# EasyEDA Pro project ProProject_ESP32-Gateway_2023-11-01.epro, schematic Schematic1
Create Date: 2023-10-16; Page Name: P1; Project Name: ESP32-Gateway; Schematic Name: Schematic1; Update Date: 2023-10-28; Company: Zheyuan Zhang; Page Size: A3; Version: V2.2
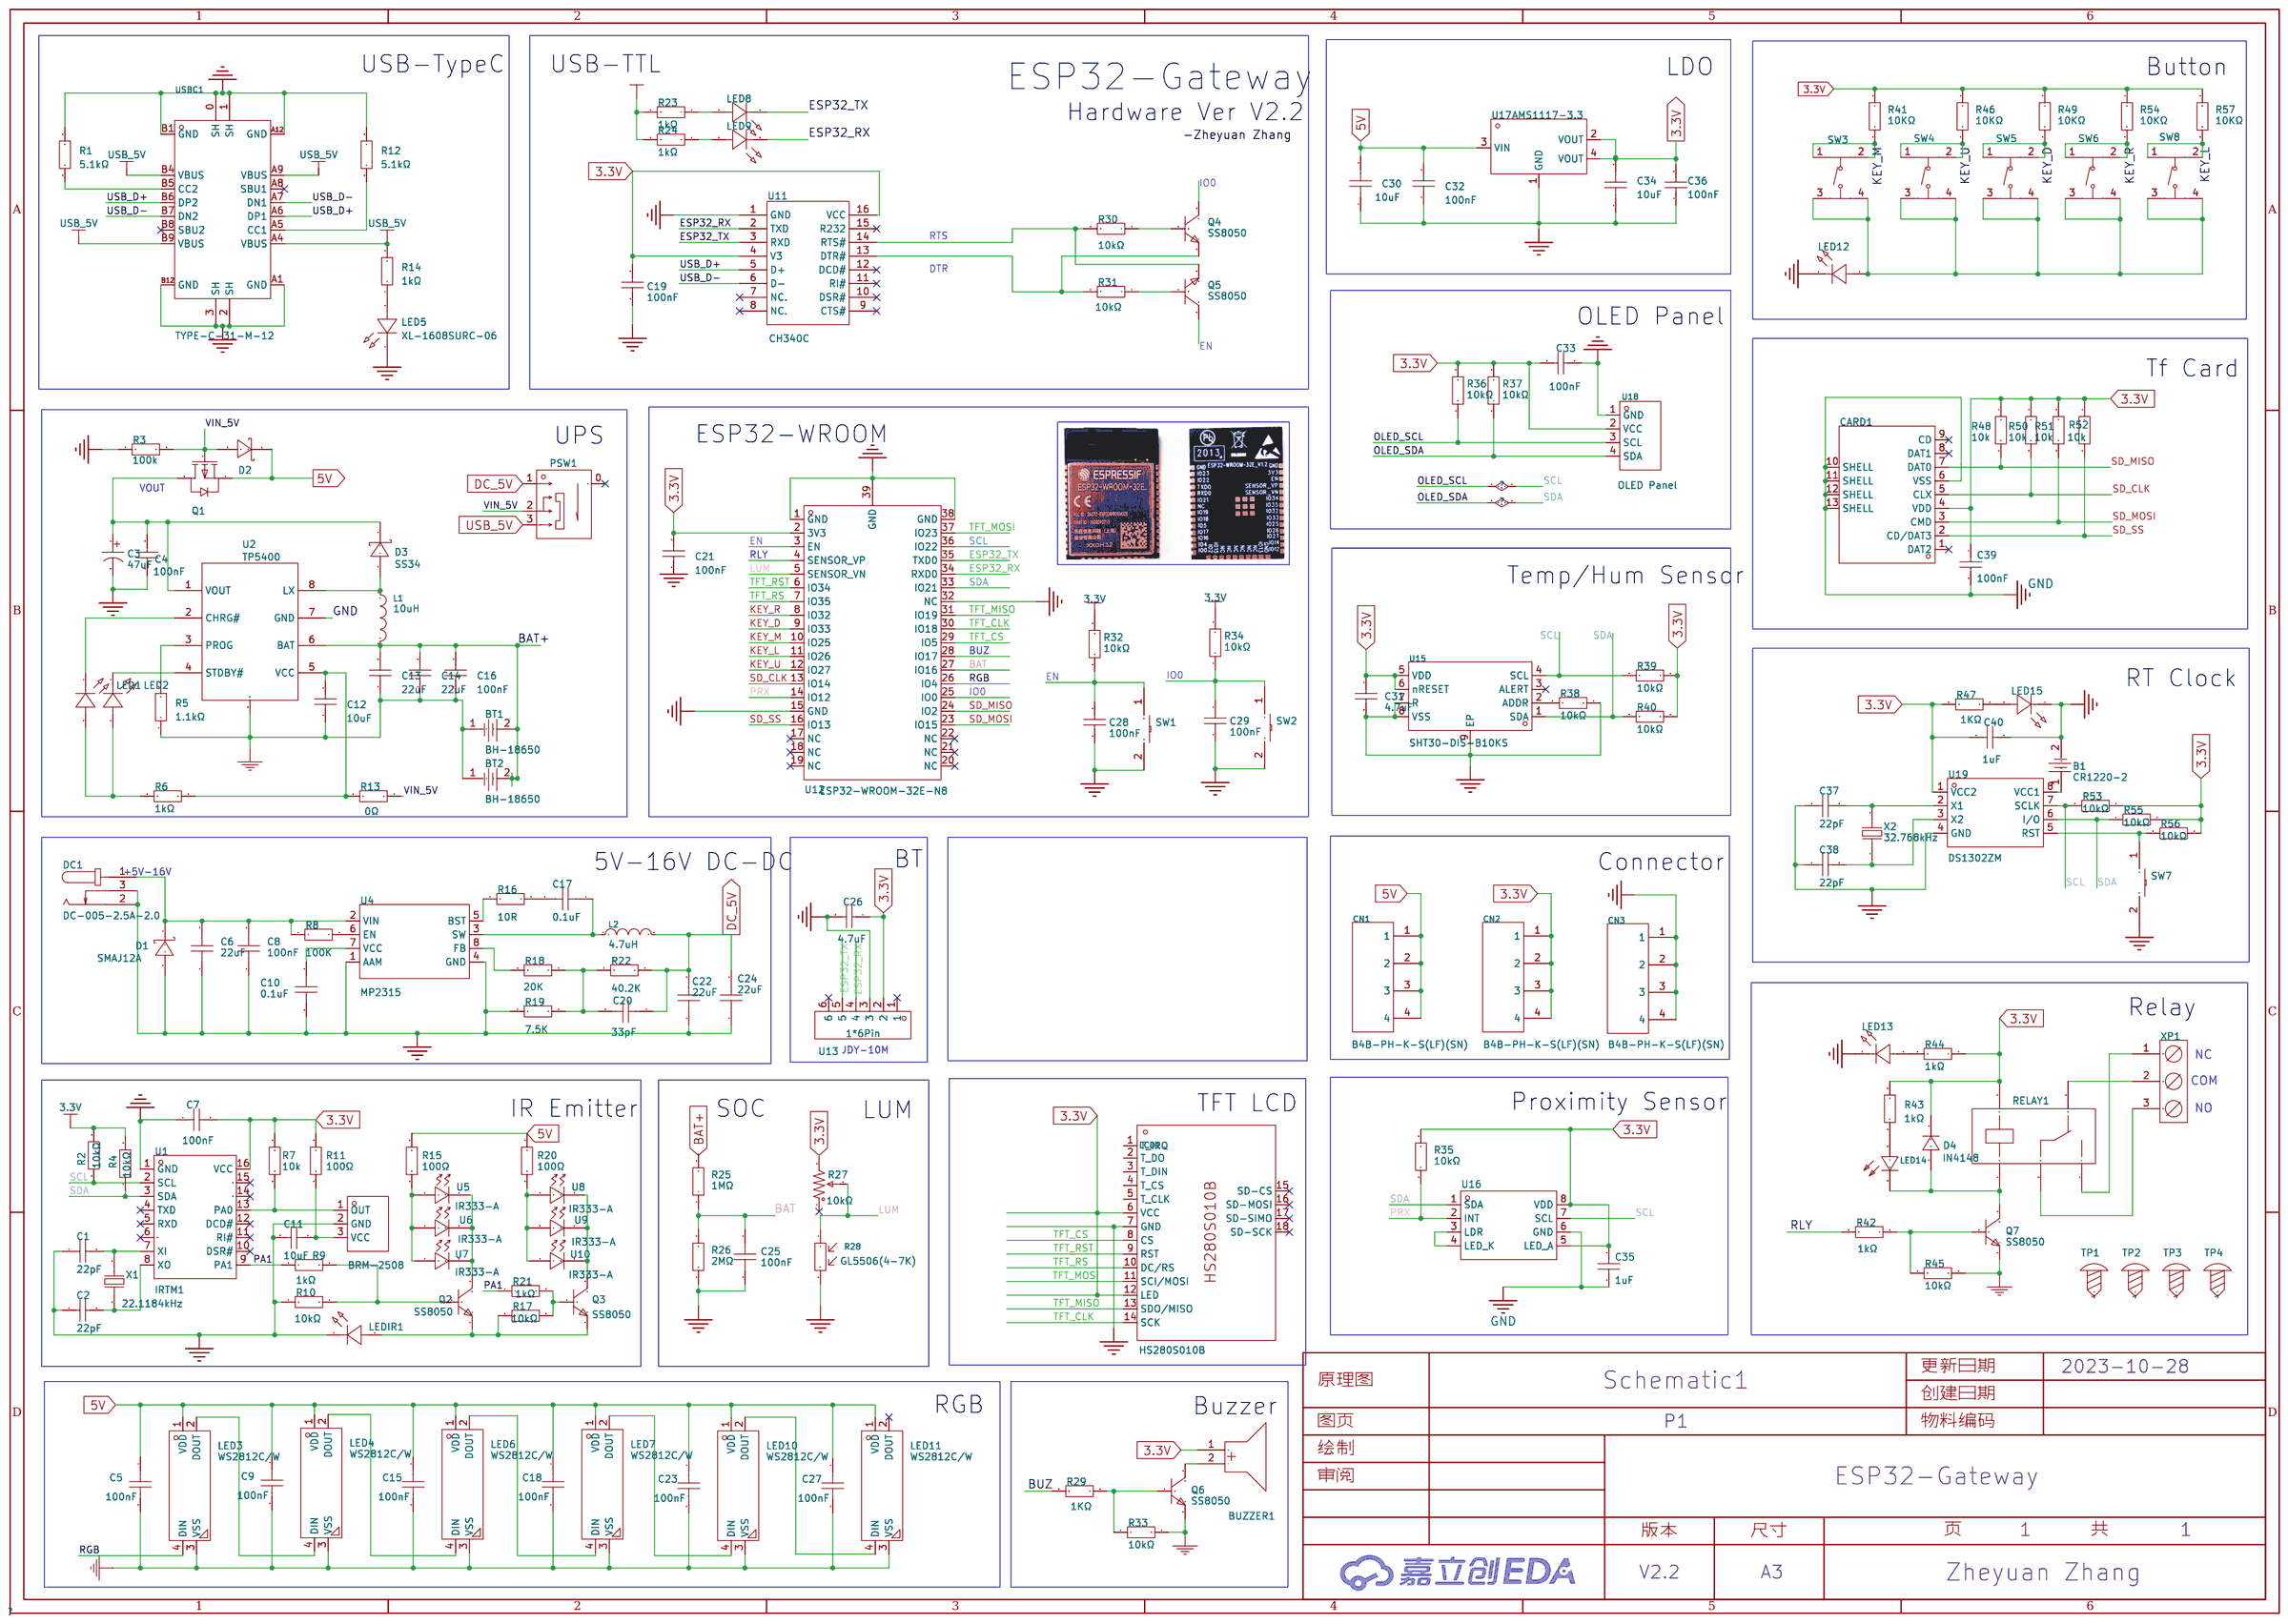
[diagram p2: schematic sheet]

## Parts
B1  CR1220-2  [BAT-SMD_CR1220-2]
BT1  BH-18650  [BAT-TH_BH-18650-A1AJ005]
BT2  BH-18650  [BAT-TH_BH-18650-A1AJ005]
BUZZER1  HNB09A03  [BUZ-TH_BD9.0-P5.00-D0.6-FD]
C1  22pF  [C0603]
C2  22pF  [C0603]
C3  47uF  [CAP-TH_BD6.3-P2.50-D1.0-FD]
C4  100nF  [C0805]
C5  100nF  [C0603]
C6  22uF  [C0805]
C7  100nF  [C0805]
C8  100nF  [C0805]
C9  100nF  [C0603]
C10  0.1uF  [C0603]
C11  10uF  [C0805]
C12  10uF  [C0805]
C13  22uF  [C0805]
C14  22uF  [C0805]
C15  100nF  [C0603]
C16  100nF  [C0805]
C17  0.1uF  [C0603]
C18  100nF  [C0603]
C19  100nF  [C0603]
C20  33pF  [C0603]
C21  100nF  [C0805]
C22  22uF  [C0805]
C23  100nF  [C0603]
C24  22uF  [C0805]
C25  100nF  [C0603]
C26  4.7uF  [C0603]
C27  100nF  [C0603]
C28  100nF  [C0603]
C29  100nF  [C0603]
C30  10uF  [C0603]
C31  4.7uF  [C0603]
C32  100nF  [C0603]
C33  100nF  [C0603]
C34  10uF  [C0603]
C35  1uF  [C0603]
C36  100nF  [C0603]
C37  22pF  [C0603]
C38  22pF  [C0603]
C39  100nF  [C0603]
C40  1uF  [C0603]
CARD1  -  [TF-SMD_THD2528-11SD-GF]
CN1  B4B-PH-K-S(LF)(SN)  [CONN-TH_B4B-PH-K-S]
CN2  B4B-PH-K-S(LF)(SN)  [CONN-TH_B4B-PH-K-S]
CN3  B4B-PH-K-S(LF)(SN)  [CONN-TH_B4B-PH-K-S]
D1  SMAJ12A  [SMA_L4.4-W2.7-LS5.1-RD]
D2  -  [SMA_L4.3-W2.6-LS5.1-RD]
D3  SS34  [DO-214AC_L4.3-W2.7-LS5.3-RD]
D4  IN4148  [DO-35_BD2.0-L4.2-P8.20-D0.5-R-RD]
DC1  DC-005-2.5A-2.0  [CONN-TH_DC-005-2.5A-2.0]
L1  10uH  [IND-SMD_L4.0-W4.0]
L2  4.7uH  [IND-SMD_L5.4-W5.2_FXL0530]
LCD1  HS280S010B  [LCD-TH_HS280S010B]
LED1  XL-1608SURC-06  [LED0603-RD_RED]
LED2  XL-1608SURC-06  [LED0603-RD_RED]
LED3  WS2812C/W  [LED-SMD_4P-L5.0-W5.0-TL_WS2812B-B]
LED4  WS2812C/W  [LED-SMD_4P-L5.0-W5.0-TL_WS2812B-B]
LED5  XL-1608SURC-06  [LED0603-RD_RED]
LED6  WS2812C/W  [LED-SMD_4P-L5.0-W5.0-TL_WS2812B-B]
LED7  WS2812C/W  [LED-SMD_4P-L5.0-W5.0-TL_WS2812B-B]
LED8  XL-1608SURC-06  [LED0603-RD_RED]
LED9  XL-1608SURC-06  [LED0603-RD_RED]
LED10  WS2812C/W  [LED-SMD_4P-L5.0-W5.0-TL_WS2812B-B]
LED11  WS2812C/W  [LED-SMD_4P-L5.0-W5.0-TL_WS2812B-B]
LED12  XL-1608SURC-06  [LED0603-RD_RED]
LED13  XL-1608SURC-06  [LED0603-RD_RED]
LED14  19-217/GHC-YR1S2/3T  [LED0603-RD]
LED15  XL-1608SURC-06  [LED0603-RD_RED]
LEDIR1  XL-1608SURC-06  [LED0603-RD_RED]
PSW1  SK-3296S-01-L1  [SW-SMD_3P-P1.50_L2.7-W6.6]
Q1  -  [SOT-23_L2.9-W1.3-P1.90-LS2.4-BR]
Q2  SS8050  [SOT-23-3_L2.9-W1.3-P1.90-LS2.4-BR]
Q3  SS8050  [SOT-23-3_L2.9-W1.3-P1.90-LS2.4-BR]
Q4  SS8050  [SOT-23-3_L2.9-W1.3-P1.90-LS2.4-BR]
Q5  SS8050  [SOT-23-3_L2.9-W1.3-P1.90-LS2.4-BR]
Q6  SS8050  [SOT-23-3_L2.9-W1.3-P1.90-LS2.4-BR]
Q7  SS8050  [SOT-23-3_L2.9-W1.3-P1.90-LS2.4-BR]
R1  5.1kΩ  [R0603]
R2  10kΩ  [R0603]
R3  100k  [R0603]
R4  10kΩ  [R0603]
R5  1.1kΩ  [R0603]
R6  1kΩ  [R0603]
R7  10k  [R0603]
R8  100K  [R0603]
R9  1kΩ  [R0603]
R10  10kΩ  [R0603]
R11  100Ω  [R0603]
R12  5.1kΩ  [R0603]
R13  0Ω  [R0603]
R14  1kΩ  [R0603]
R15  100Ω  [R0603]
R16  10R  [R0603]
R17  10kΩ  [R0603]
R18  20K  [R0603]
R19  7.5K  [R0603]
R20  100Ω  [R0603]
R21  1kΩ  [R0603]
R22  40.2K  [R0603]
R23  1kΩ  [R0603]
R24  1kΩ  [R0603]
R25  1MΩ  [R0603]
R26  2MΩ  [R0603]
R27  10kΩ  [RES-ADJ-TH_3362P]
R28  GL5506(4-7K)  [RES-TH_L5.1-W4.3-P3.00-D0.5]
R29  1KΩ  [R0603]
R30  10kΩ  [R0603]
R31  10kΩ  [R0603]
R32  10kΩ  [R0603]
R33  10kΩ  [R0603]
R34  10kΩ  [R0603]
R35  10kΩ  [R0603]
R36  10kΩ  [R0603]
R37  10kΩ  [R0603]
R38  10kΩ  [R0603]
R39  10kΩ  [R0603]
R40  10kΩ  [R0603]
R41  10KΩ  [R0603]
R42  1kΩ  [R0603]
R43  1kΩ  [R0603]
R44  1kΩ  [R0603]
R45  10kΩ  [R0603]
R46  10KΩ  [R0603]
R47  1KΩ  [R0603]
R48  10k  [R0603]
R49  10KΩ  [R0603]
R50  10k  [R0603]
R51  10k  [R0603]
R52  10k  [R0603]
R53  10kΩ  [R0603]
R54  10KΩ  [R0603]
R55  10kΩ  [R0603]
R56  10kΩ  [R0603]
R57  10KΩ  [R0603]
RELAY1  HF32F/012-ZS3  [RELAY-TH_HF32F-012-ZS3]
SW1  TS-1101-C-W  [SW-SMD_L6.0-W3.3-LS8.0]
SW2  TS-1101-C-W  [SW-SMD_L6.0-W3.3-LS8.0]
SW3  TS-1187A-B-A-B  [SW-SMD_4P-L5.1-W5.1-P3.70-LS6.5-TL-2]
SW4  TS-1187A-B-A-B  [SW-SMD_4P-L5.1-W5.1-P3.70-LS6.5-TL-2]
SW5  TS-1187A-B-A-B  [SW-SMD_4P-L5.1-W5.1-P3.70-LS6.5-TL-2]
SW6  TS-1187A-B-A-B  [SW-SMD_4P-L5.1-W5.1-P3.70-LS6.5-TL-2]
SW7  TS-1101-C-W  [SW-SMD_L6.0-W3.3-LS8.0]
SW8  TS-1187A-B-A-B  [SW-SMD_4P-L5.1-W5.1-P3.70-LS6.5-TL-2]
TP1  -  [M2螺丝]
TP2  -  [M2螺丝]
TP3  -  [M2螺丝]
TP4  -  [M2螺丝]
U1  IRTM1  [SOIC-16_L9.9-W3.9-P1.27-LS6.0-BL]
U2  TP5400  [SOIC-8_L5.0-W4.0-P1.27-LS6.0-BL-EP2.0]
U3  BRM-2508  [SENSOR-TG_TSOP38236]
U4  MP2315  [SOT-23-8_L3.0-W1.7-P0.65-LS2.8-BR]
U5  IR333-A  [LED-TH_BD6.2-P2.54-FD]
U6  IR333-A  [LED-TH_BD6.2-P2.54-FD]
U7  IR333-A  [LED-TH_BD6.2-P2.54-FD]
U8  IR333-A  [LED-TH_BD6.2-P2.54-FD]
U9  IR333-A  [LED-TH_BD6.2-P2.54-FD]
U10  IR333-A  [LED-TH_BD6.2-P2.54-FD]
U11  CH340C  [SOP-16_L10.0-W3.9-P1.27-LS6.0-BL]
U12  ESP32-WROOM-32E-N8  [WIFI-SMD_ESP32-WROOM-32E]
U13  1*6Pin  [CONN-TH_6P-P2.54_DEALON_DW254W-11-06-85]
U15  SHT30-DIS-B10KS  [DFN-8_L2.5-W2.5-P0.50-BL-EP]
U16  -  [SENSOR-SMD_L3.9-W2.4-P0.95-BL]
U17  AMS1117-3.3  [SOT-223-3_L6.5-W3.4-P2.30-LS7.0-BR]
U18  OLED Panel  [OLED-TH_L27.8-W27.2-P2.54_C9900033791]
U19  DS1302ZM  [SOP-8_L4.9-W3.9-P1.27-LS6.0-BL]
USBC1  TYPE-C-31-M-12  [USB-C_SMD-TYPE-C-31-M-12]
X1  22.1184kHz  [FC-135R_L3.2-W1.5]
X2  32.768kHz  [FC-135R_L3.2-W1.5]
XP1  KF128L-5.0-3P  [CONN-TH_3P-P5.00_KF128L-5.0-3P]

## Library data of the parts
B1 = CR1220-2: 连接器类型:电池底座;适用电池规格:CR1220;工作温度范围:-;; LCSC Part Name: 电池底座 适用电池:CR1220; Supplier Part: C70381; Manufacturer: Q&J; Supplier Footprint: SMD; JLCPCB Part Class: 扩展库; Datasheet: https://atta.szlcsc.com/upload/public/pdf/source/20160427/1461725216696.pdf; Supplier: LCSC; Connector Type: 电池底座; Battery Type: CR1220
BT1 BT2 = BH-18650-A1AJ005: 连接器类型:电池盒;适用电池规格:18650;; LCSC Part Name: 电池盒 适用电池:18650; Supplier Part: C5290176; Manufacturer: MYOUNG(美阳); JLCPCB Part Class: Extended Part; Datasheet: https://atta.szlcsc.com/upload/public/pdf/source/20221129/D0CEC1B107B5F52E469FD9B49033E00F.pdf; Supplier: LCSC; Connector Type: 电池盒; Battery Type: 18650
BUZZER1 = HNB09A03: Supplier: LCSC; Supplier Part: C96102; Manufacturer: Jiangsu Huaneng Elec; JLCPCB Part Class: Extended Part; Frequency: 3kHz
C1 C2 C37 C38 = CC0603JRNPO9BN220: 容值:22pF;精度:±5%;额定电压:50V;材质(温度系数):NP0;; LCSC Part Name: 22pF ±5% 50V; Supplier Part: C105620; Manufacturer: YAGEO(国巨); Supplier Footprint: 0603; JLCPCB Part Class: 扩展库; Datasheet: https://atta.szlcsc.com/upload/public/pdf/source/20170425/1493115771353.pdf; Supplier: LCSC; Tolerance: ±5%; Voltage Rated: 50V; Temperature Coefficient: NP0
C3 = KM476M050E11RR0VH2FP0: 容值:47uF;精度:±20%;额定电压:50V;电容体直径:6.3mm;电容体长度:11mm;脚间距:2.5mm;工作寿命:1000hrs@105℃;; LCSC Part Name: 47uF ±20% 50V; Supplier Part: C45101; Manufacturer: CX(承兴); Supplier Footprint: 插件,D6.3xL11mm; JLCPCB Part Class: Extended Part; Datasheet: https://atta.szlcsc.com/upload/public/pdf/source/20151029/1457707529552.pdf; Supplier: LCSC; Tolerance: ±20%; Rated Voltage: 50V; φD: 6.3mm; L: 11mm; Lead Spacing: 2.5mm; Lifetime @ Temp: 1000hrs@105℃
C4 C7 C11-C14 C16 C21 = CC0805KRX7R9BB104: 容值:100nF;精度:±10%;额定电压:50V;材质(温度系数):X7R;; LCSC Part Name: 100nF ±10% 50V; Supplier Part: C49678; Manufacturer: YAGEO(国巨); Supplier Footprint: 0805; JLCPCB Part Class: 基础库; Datasheet: https://atta.szlcsc.com/upload/public/pdf/source/20151026/1457707504898.pdf; Supplier: LCSC; Tolerance: ±10%; Voltage Rated: 50V; Temperature Coefficient: X7R
C5 C9 C15 C18 C23 C27 = CL10B104KB8NNNC: Supplier: LCSC; Manufacturer: SAMSUNG; Supplier Part: C1591; JLCPCB Part Class: Extended Part
C6 C22 C24 = CL21A226MAYNNNE: 容值:22uF;精度:±20%;额定电压:25V;材质(温度系数):X5R;; LCSC Part Name: 22uF ±20% 25V; Supplier Part: C602037; Manufacturer: SAMSUNG(三星); Supplier Footprint: 0805; JLCPCB Part Class: Extended Part; Datasheet: https://atta.szlcsc.com/upload/public/pdf/source/20200609/C602037_1A0D619693E608A1BF6E80154254E2DB.pdf; Supplier: LCSC; Tolerance: ±20%; Voltage Rated: 25V; Temperature Coefficient: X5R
C8 = CC0805KRX7R9BB104: 容值:100nF;精度:±10%;额定电压:50V;材质(温度系数):X7R;; LCSC Part Name: 100nF ±10% 50V; Supplier Part: C49678; Manufacturer: YAGEO(国巨); Supplier Footprint: 0805; JLCPCB Part Class: Basic Part; Datasheet: https://atta.szlcsc.com/upload/public/pdf/source/20180224/C181747_15194369449651363981.pdf; Supplier: LCSC; Tolerance: ±10%; Voltage Rated: 50V; Temperature Coefficient: X7R
C10 C17 C20 C25 = CAP_0603: Supplier Footprint: 0603
C19 C28 C29 C32 C33 C36 = 0603B104K500NT: 容值:100nF;精度:±10%;额定电压:50V;材质(温度系数):X7R;; LCSC Part Name: 100nF ±10% 50V; Supplier Part: C30926; Manufacturer: FH(风华); Supplier Footprint: 0603; JLCPCB Part Class: 扩展库; Datasheet: https://atta.szlcsc.com/upload/public/pdf/source/20170923/C30926_1506149436298988724.pdf; Supplier: LCSC; Tolerance: ±10%; Voltage Rated: 50V; Temperature Coefficient: X7R
C26 C31 = CL10A475KP8NNNC: 容值:4.7uF;精度:±10%;额定电压:10V;材质(温度系数):X5R;; LCSC Part Name: 4.7uF ±10% 10V; Supplier Part: C1705; Manufacturer: SAMSUNG(三星); Supplier Footprint: 0603; JLCPCB Part Class: Extended Part; Datasheet: https://atta.szlcsc.com/upload/public/pdf/source/20160103/1457707692180.pdf; Supplier: LCSC; Tolerance: ±10%; Voltage Rated: 10V; Temperature Coefficient: X5R
C30 C34 = CL10A106KP8NNNC: 容值:10uF;精度:±10%;额定电压:10V;材质(温度系数):X5R;; LCSC Part Name: 10uF ±10% 10V; Supplier Part: C19702; Manufacturer: SAMSUNG(三星); Supplier Footprint: 0603; JLCPCB Part Class: 基础库; Datasheet: https://atta.szlcsc.com/upload/public/pdf/source/20160103/1457707703378.pdf; Supplier: LCSC; Tolerance: ±10%; Voltage Rated: 10V; Temperature Coefficient: X5R
C35 = CC0805KRX7R9BB104: 容值:100nF;精度:±10%;额定电压:50V;温度系数:X7R;; LCSC Part Name: 100nF ±10% 50V; Supplier Part: C15849; Manufacturer: YAGEO(国巨); Supplier Footprint: 0603; JLCPCB Part Class: Basic Part; Datasheet: https://atta.szlcsc.com/upload/public/pdf/source/20151026/1457707504898.pdf; Supplier: LCSC; Tolerance: ±10%; Voltage Rated: 50V; Temperature Coefficient: X7R
C39 = CC0805KRX7R9BB104: 容值:100nF;精度:±10%;额定电压:50V;温度系数:X7R;; LCSC Part Name: 100nF ±10% 50V; Supplier Part: C14663; Manufacturer: YAGEO(国巨); Supplier Footprint: 0805; JLCPCB Part Class: Basic Part; Datasheet: https://atta.szlcsc.com/upload/public/pdf/source/20151026/1457707504898.pdf; Supplier: LCSC; Tolerance: ±10%; Voltage Rated: 50V; Temperature Coefficient: X7R
C40 = CL10A105KB8NNNC: 容值:1uF;精度:±10%;额定电压:50V;材质(温度系数):X5R;; LCSC Part Name: 1uF ±10% 50V; Supplier Part: C15849; Manufacturer: SAMSUNG(三星); Supplier Footprint: 0603; JLCPCB Part Class: Basic Part; Datasheet: https://atta.szlcsc.com/upload/public/pdf/source/20160103/1457707679084.pdf; Supplier: LCSC; Tolerance: ±10%; Voltage Rated: 50V; Temperature Coefficient: X5R
CARD1 = THD2528-11SD-GF: 卡连接方式:自弹式;卡类型:MicroSD卡(TF卡);连接器类型:卡座;本体最大高度:2mm;工作温度范围:-;; LCSC Part Name: 自弹式 MicroSD卡(TF卡) 卡座 外焊; Supplier Part: C283232; Manufacturer: THD(台华达); Supplier Footprint: SMD; Datasheet: https://atta.szlcsc.com/upload/public/pdf/source/20190329/C283232_532F94C79FB51CC42613BF324E8B5690.pdf; Supplier: LCSC; Card Connection Mode: 自弹式; Card Type: MicroSD卡(TF卡); Connector Type: 卡座; Maximum Body Height: 2mm; JLCPCB Part Class: Extended Part
CN1-CN3 = B4B-PH-K-S(LF)(SN): 参考系列:PH;间距:2mm;插针结构:1x4P;排数:1;每排PIN数:4;行距:-;安装方式:-;触头材质:黄铜;; LCSC Part Name: PH 2mm 1x4P; Supplier Part: C131334; Manufacturer: JST; Supplier Footprint: 插件,P=2mm; JLCPCB Part Class: 扩展库; Datasheet: https://atta.szlcsc.com/upload/public/pdf/source/20171026/C131342_15089839687311058815.pdf; Supplier: LCSC; Reference Series: PH; Pitch: 2mm; Pins Structure: 1x4P; Number of Rows: 1; Number of PINs Per Row: 4; Contact Material: 黄铜
D1 = SMAJ12A_C152123: 极性:单向;反向截止电压(Vrwm):12V;击穿电压:13.3V;峰值脉冲电流(Ipp)@10/1000μs:20.1A;最大钳位电压:19.9V;; LCSC Part Name: 单向 Vrwm:12V; Supplier Part: C152123; Manufacturer: BORN(伯恩半导体); Supplier Footprint: SMA(DO-214AC); JLCPCB Part Class: Extended Part; Datasheet: https://atta.szlcsc.com/upload/public/pdf/source/20181205/C152123_F062F647BF686681D55A64EEC7CBEC59.pdf; Supplier: LCSC; Polarity: 单向; Reverse Stand-Off Voltage (Vrwm): 12V; Breakdown Voltage: 13.3V; Peak Pulse Current (Ipp)@10/1000μs: 20.1A; Maximum Clamping Voltage: 19.9V
D2 = SS34: 直流反向耐压(Vr):40V;平均整流电流(Io):3A;正向压降(Vf):550mV@3A;; LCSC Part Name: 40V 3A 550mV@3A (SMA打扁); Supplier Part: C355267; Manufacturer: SINO-IC(光宇睿芯); Supplier Footprint: SMA; Datasheet: https://atta.szlcsc.com/upload/public/pdf/source/20190731/C355267_DFDD47B37D7A4339E7036B819780E55C.pdf; Supplier: LCSC; Reverse Voltage (Vr): 40V; Average Rectified Current (Io): 3A; Forward Voltage (Vf@If): 550mV@3A; JLCPCB Part Class: Extended Part
D3 = SS34: Supplier: LCSC; Manufacturer: MDD; Supplier Part: C8678; JLCPCB Part Class: Basic Part
D4 = IN4148: Supplier: LCSC; Supplier Part: C14538; Manufacturer: Semtech
DC1 = DC-005-2.5A-2.0: 连接器类型:DC电源插座;安装方式:面板安装;触点内径:2mm;触点外径:6.2mm;额定电流:2.5A;额定电压:24V;触头材质:黄铜;工作温度范围:-20℃~+70℃;焊接温度(最大值):260℃;; LCSC Part Name: DC电源插座 内径:2mm 外径:6.2mm; Supplier Part: C319099; Manufacturer: XKB Connectivity(中国星坤); Supplier Footprint: 插件; JLCPCB Part Class: Extended Part; Datasheet: https://atta.szlcsc.com/upload/public/pdf/source/20230410/3C172F25A51FCA230ABE6D36425CBB3B.pdf; Supplier: LCSC; Connector Type: DC电源插座; Mounting Style: 面板安装; Inside Contact Diameter: 2mm; Outside Contact Diameter: 6.2mm; Current Rating (Max): 2.5A; Voltage Rating (Max): 24V; Contact Material: 黄铜; Operating Temperature Range: -20℃~+70℃; Welding Temperature (Max): 260℃
L1 = SWPA4030S100MT: 类型:-;电感值:10uH;精度:±20%;额定电流:1.5A;饱和电流(Isat):2.4A;; LCSC Part Name: 10uH ±20% 2.4A; Supplier Part: C38117; Manufacturer: Sunlord(顺络); Supplier Footprint: SMD; JLCPCB Part Class: Extended Part; Datasheet: https://atta.szlcsc.com/upload/public/pdf/source/20210916/AC798BA7E846B7D0B6818F45CD84DB0B.pdf; Supplier: LCSC; Tolerance: ±20%; Rated Current: 1.5A; Saturation Current (Isat): 2.4A; DC Resistance (DCR): 130mΩ; Q @ Freq: 30@2MHz; Frequency - Self Resonant: 2MHz
L2 = FXL0530-4R7-M: 电感值:4.7uH;精度:±20%;额定电流:4.5A;饱和电流(Isat):5A;; LCSC Part Name: 4.7uH ±20% 4.5A 50mΩ; Supplier Part: C177246; Manufacturer: cjiang(长江微电); Supplier Footprint: SMD,5.4x5.2x2.8mm; JLCPCB Part Class: 扩展库; Supplier: LCSC; Tolerance: ±20%; Rated Current: 4.5A; Saturation Current (Isat): 5A; DC Resistance (DCR): 50mΩ
LCD1 = HS280S010B: 尺寸(inch):2.8;主控芯片:ST7789V;; LCSC Part Name: 2.8寸TFT-LCD液晶屏LCM显示屏; Supplier Part: C2939938; Manufacturer: HS(汉昇); Datasheet: https://atta.szlcsc.com/upload/public/pdf/source/20220301/BE70A47BD1B5FAAC1B1134425FD228F4.pdf; Supplier: LCSC; Size: 2.8; Main Control Chip: ST7789V
LED1 LED2 LED5 LED8 LED9 LED12 LED13 LED15 LEDIR1 = XL-1608SURC-06: 发光颜色:红灯;主波长:617nm~621nm;色温:-;功率:55mW;安装方式:正贴;; LCSC Part Name: 红灯 正贴; Supplier Part: C965799; Manufacturer: XINGLIGHT(成兴光); Supplier Footprint: 0603; JLCPCB Part Class: 扩展库; Datasheet: https://atta.szlcsc.com/upload/public/pdf/source/20221102/D860AFDD1CDB02C5A8064103A32707E2.pdf; Supplier: LCSC; Emitted Color: 红灯; Lens Color: 无色透明; Dominant Wavelength: 617nm~621nm; Peak Wavelength: 623nm; Forward Current: 25mA; Power Dissipation: 55mW; Viewing Angle: 120°; Mounting Sytle: 正贴; Operating Temperature: -30℃~+85℃
LED3 LED4 LED6 LED7 LED10 LED11 = WS2812C/W: Supplier: LCSC; Supplier Part: C2761796; Manufacturer: worldsemi; JLCPCB Part Class: Extended Part
LED14 = 19-217/GHC-YR1S2/3T: 发光颜色:翠绿;二极管配置:-;主波长:520nm~535nm;色温:-;功率:110mW;安装方式:-;; LCSC Part Name: 翠绿; Supplier Part: C72043; Manufacturer: EVERLIGHT(亿光); Supplier Footprint: 0603; JLCPCB Part Class: 基础库; Datasheet: https://atta.szlcsc.com/upload/public/pdf/source/20160507/1462613613780.pdf; Supplier: LCSC; Emitted Color: 翠绿; Lens Color: 无色透明; Dominant Wavelength: 520nm~535nm; Peak Wavelength: 518nm; Forward Current: 20mA; Power Dissipation: 110mW; Viewing Angle: 120°; Operating Temperature: -40℃~+85℃
PSW1 = SK-3296S-01-L1: Supplier: LCSC; Supplier Part: C319020; Manufacturer: XKB Enterprise; JLCPCB Part Class: Extended Part
Q1 = SI2305: 类型:P沟道;漏源电压(Vdss):20V;连续漏极电流(Id):4.1A;功率(Pd):1.25W;导通电阻(RDS(on)@Vgs,Id):52m@4.5V,4.1A;阈值电压(Vgs(th)@Id):1V@250A;; LCSC Part Name: P沟道 20V 4.1A; Supplier Part: C344006; Manufacturer: BORN伯恩半导体; Supplier Footprint: SOT-23; Datasheet: https://atta.szlcsc.com/upload/public/pdf/source/20181211/C344006_B14C481D34E4DBCC9865316765F4D8FD.pdf; Supplier: LCSC; Type: P沟道; Drain Source Voltage (Vdss): 20V; Continuous Drain Current (Id): 4.1A; Power Dissipation (Pd): 1.25W; Drain Source On Resistance (RDS(on)@Vgs,Id): 52m@4.5V,4.1A; Gate Threshold Voltage (Vgs(th)@Id): 1V@250A; JLCPCB Part Class: Extended Part
Q2-Q7 = SS8050_C2150: 晶体管类型:NPN;集射极击穿电压(Vceo):25V;集电极电流(Ic):1.5A;功率(Pd):300mW;直流电流增益(hFE@Ic,Vce):200@100mA,1V;; LCSC Part Name: NPN 25V 1.5A Y1 200-350; Supplier Part: C2150; Manufacturer: CJ(江苏长电/长晶); Supplier Footprint: SOT-23; JLCPCB Part Class: 基础库; Datasheet: https://atta.szlcsc.com/upload/public/pdf/source/20230322/AEE86F4B043774EFF80CAEA14A37D9E9.pdf; Supplier: LCSC; Transistor Type: NPN; Collector-Emitter Breakdown Voltage (Vceo): 25V; Collector Current (Ic): 1.5A; Power Dissipation (Pd): 300mW; Collector Cut-Off Current (Icbo): 100nA; Collector-Emitter Saturation Voltage (VCE(sat)@Ic,Ib): 500mV@800mA,80mA; DC Current Gain (hFE@Ic,Vce): 200@100mA,1V; Transition Frequency (fT): 100MHz; Operating Temperature: +150℃@(Tj)
R1 R12 = 0603WAF5101T5E: 电阻类型:厚膜电阻;阻值:5.1kΩ;精度:±1%;功率:100mW;; LCSC Part Name: 5.1kΩ ±1% 100mW; Supplier Part: C23186; Manufacturer: UNI-ROYAL(厚声); Supplier Footprint: 0603; JLCPCB Part Class: Basic Part; Datasheet: https://atta.szlcsc.com/upload/public/pdf/source/20200306/C422600_1E6D84923E4A46A82E41ADD87F860B5C.pdf; Supplier: LCSC; Type: 厚膜电阻; Tolerance: ±1%; Power(Watts): 100mW; Temperature Coefficient: ±100ppm/℃; Overload Voltage (Max): 75V; Operating Temperature Range: -55℃~+155℃
R2 R4 R36 R37 = 0603WAF4701T5E: 电阻类型:厚膜电阻;阻值:4.7kΩ;精度:±1%;功率:100mW;; LCSC Part Name: 4.7kΩ ±1% 100mW; Supplier Part: C23162; Manufacturer: UNI-ROYAL(厚声); Supplier Footprint: 0603; JLCPCB Part Class: Basic Part; Datasheet: https://atta.szlcsc.com/upload/public/pdf/source/20200306/C422600_1E6D84923E4A46A82E41ADD87F860B5C.pdf; Supplier: LCSC; Type: 厚膜电阻; Tolerance: ±1%; Power(Watts): 100mW; Temperature Coefficient: ±100ppm/℃; Overload Voltage (Max): 75V; Operating Temperature Range: -55℃~+155℃
R3 = TR0603B10K0P0525Z: 电阻类型:薄膜电阻;阻值:10k;精度:±0.1%;功率:100mW;温度系数:±25ppm/;最大工作电压:75V;工作温度范围:-55~+155;; LCSC Part Name: 10k ±0.1% 100mW; Supplier Part: C25803; Manufacturer: EVER OHMS(天二科技); Supplier Footprint: 0603; JLCPCB Part Class: Extended Part; Datasheet: https://atta.szlcsc.com/upload/public/pdf/source/20190415/C188363_433BF05B6FB8F7A0F5F35A3E4390C55A.pdf; Supplier: LCSC; Type: 薄膜电阻; Tolerance: ±0.1%; Power(Watts): 100mW; Temperature Coefficient: ±25ppm/; Overload Voltage (Max): 75V; Operating Temperature Range: -55~+155
R5 R6 R13 R14 R23 R24 R29 R41-R44 R46 R47 R49 R54 R57 = 0603WAF1001T5E: 电阻类型:厚膜电阻;阻值:1kΩ;精度:±1%;功率:100mW;温度系数:±100ppm/℃;; LCSC Part Name: 厚膜电阻 1kΩ ±1% 100mW; Supplier Part: C21190; Manufacturer: UNI-ROYAL(厚声); Supplier Footprint: 0603; Datasheet: https://atta.szlcsc.com/upload/public/pdf/source/20200306/C422600_1E6D84923E4A46A82E41ADD87F860B5C.pdf; Supplier: LCSC; Type: 厚膜电阻; Tolerance: ±1%; Power(Watts): 100mW; Temperature Coefficient: ±100ppm/℃; Overload Voltage (Max): 75V; Operating Temperature Range: -55℃~+155℃
R7 R9-R11 R15 R17 R20 R21 R25 R26 R30-R35 R38-R40 R45 R53 R55 R56 = 0603WAF1002T5E: 电阻类型:厚膜电阻;阻值:10kΩ;精度:±1%;功率:100mW;; LCSC Part Name: 厚膜电阻 10kΩ ±1% 100mW; Supplier Part: C25804; Manufacturer: UNI-ROYAL(厚声); Supplier Footprint: 0603; JLCPCB Part Class: Basic Part; Datasheet: https://atta.szlcsc.com/upload/public/pdf/source/20200306/C422600_1E6D84923E4A46A82E41ADD87F860B5C.pdf; Supplier: LCSC; Type: 厚膜电阻; Tolerance: ±1%; Power(Watts): 100mW; Temperature Coefficient: ±100ppm/℃; Overload Voltage (Max): 75V; Operating Temperature Range: -55℃~+155℃
R8 R16 R18 R19 R22 = Res_0603: Supplier Footprint: 0603
R27 = 3362P-1-103: 阻值:10kΩ;精度:±10%;; LCSC Part Name: 10kΩ ±10%; Supplier Part: C118956; Manufacturer: BOCHEN(博晨); Supplier Footprint: 插件; JLCPCB Part Class: Extended Part; Datasheet: https://atta.szlcsc.com/upload/public/pdf/source/20171114/C118956_15106326650691117445.pdf; Supplier: LCSC; Tolerance: ±10%
R28 = GL5506（4-7K）: 光谱峰值(波长):540nm;最大电压:150V;亮电阻 @ 10Lux:4kΩ~7kΩ;暗电阻:500kΩ;; LCSC Part Name: GL5506（4-7K）不环保; Supplier Part: C11299; Manufacturer: JCHL(晶创和立); Supplier Footprint: 插件,P=3mm; Supplier: LCSC; Spectral Peak: 540nm; Applied Voltage: 150V; Illuminated Resistance @ 10Lux: 4kΩ~7kΩ; Dark Resistance: 500kΩ
R48 R50-R52 = TR0603B10K0P0525Z: 电阻类型:薄膜电阻;阻值:10k;精度:±0.1%;功率:100mW;温度系数:±25ppm/;最大工作电压:75V;工作温度范围:-55~+155;; LCSC Part Name: 10k ±0.1% 100mW; Supplier Part: C188363; Manufacturer: EVER OHMS(天二科技); Supplier Footprint: 0603; JLCPCB Part Class: Extended Part; Datasheet: https://atta.szlcsc.com/upload/public/pdf/source/20190415/C188363_433BF05B6FB8F7A0F5F35A3E4390C55A.pdf; Supplier: LCSC; Type: 薄膜电阻; Tolerance: ±0.1%; Power(Watts): 100mW; Temperature Coefficient: ±25ppm/; Overload Voltage (Max): 75V; Operating Temperature Range: -55~+155
RELAY1 = HF32F/012-ZS3: 线圈电压:12V;引脚数:5;触点形式:一组转换:1C(单刀双掷-转换);触点材料:AgNi;; LCSC Part Name: 超小型中功率12V继电器 单刀双掷; Supplier Part: C3633; Manufacturer: HF(宏发); Supplier Footprint: 插件,10.2x18.4mm; JLCPCB Part Class: 扩展库; Datasheet: https://atta.szlcsc.com/upload/public/pdf/source/20180326/C3633_9A986DBC07027B346D5AB66CD2FF48EE.pdf; Supplier: LCSC; Coil Voltage: 12V; Coil Type: 非极化-单线圈; Pin Number: 5; Contact Form: 一组转换:1C(单刀双掷-转换); Maximum Switching Current: 3A; Maximum Switching Voltage: 250V@AC；30V@DC; Coil Rated Power: 450mW; Coil Resistance: 320Ω; Operate Time: 8ms; Release Time: 5ms; Contact Resistance: 100mΩ; Contact Material: AgNi; Operating Temperature: -40℃~+70℃
SW1 SW2 SW7 = TS-1101-C-W: 触点电流:50mA;额定电压(AC):-;额定电压(DC):12V;额定功率:-;绝缘电阻:-;电路结构:单刀单掷;安装方式:立贴;带灯:无;作用力:260gf;机械寿命:5万次;带支架:否;; LCSC Part Name: 立贴 6*3.6*2.5mm 轻触开关 一型3*6*2.5有白ZD b拉伸白色带淡绿按键 卷装; Supplier Part: C318938; Manufacturer: XKB Connectivity(中国星坤); Supplier Footprint: SMD; JLCPCB Part Class: 扩展库; Datasheet: https://atta.szlcsc.com/upload/public/pdf/source/20200227/C318938_C2E53B1EEDE37D980A33616AC086DE53.pdf; Supplier: LCSC; Contact Current: 50mA; Voltage Rating (DC): 12V; Circuit: 单刀单掷; Mounting Style: 立贴; Actuator Style: 矩形按钮; Actuator/Cap Color: 白色带淡绿; With Lamp: 无; Operating Force: 260gf; Mechanical Life: 5万次; Operating Temperature: -30℃~+85℃; Switch Length: 6mm; Switch Width: 3.6mm; Switch Height: 2.5mm; Strike Gundam: 否
SW3-SW6 SW8 = TS-1187A-B-A-B: Supplier: LCSC; Supplier Part: C318884; Manufacturer: XKB Enterprise; JLCPCB Part Class: Basic Part
TP1-TP4 = M2螺丝: Supplier Footprint: 插件
U1 = IRTM1: 应用功能:收发器;接口协议:USB 2.0;数据速率:2Mbps;; LCSC Part Name: USB转串口芯片 CH340; Supplier Part: C14267; Manufacturer: WCH(南京沁恒); Supplier Footprint: SOP-16; JLCPCB Part Class: 扩展库; Datasheet: https://atta.szlcsc.com/upload/public/pdf/source/20230530/6E401E9554E9F5311886CC8B3F89B62E.pdf; Supplier: LCSC; Applications Function: 收发器; Protocol: USB 2.0; Data Rate: 2Mbps; Supply Voltage: 3.3V；5V
U2 = TP5400: Supplier: LCSC; Manufacturer: TOPPOWER; Supplier Part: C24154; JLCPCB Part Class: Extended Part
U3 = BRM-2508: Supplier Part: C3742813; Manufacturer: American Bright; Supplier Footprint: SIP-3-2.54mm; Supplier: LCSC
U4 = TPS62120DCNR: 可输出电流:75mA;开关工作频率:800kHz;输出类型:Adjustable;输出电压的路数:1;功能类型:Step-Down;输出配置:Positive;; Supplier Part: C23946; Manufacturer: TI(德州仪器); Supplier Footprint: SOT-23-8; JLCPCB Part Class: Extended Part; Datasheet: https://atta.szlcsc.com/upload/public/pdf/source/20140508/1457707055961.pdf; Supplier: LCSC
U5-U10 = IR333-A: 辐射强度:20mW/sr @ 20mA;; Supplier Part: C264290; Manufacturer: EVERLIGHT(亿光); Supplier Footprint: 插件,D=5mm; Datasheet: https://atta.szlcsc.com/upload/public/pdf/source/20180817/C264290_D452DB7A7A471D82545A1C65BE35F27E.pdf; Supplier: LCSC; Radiant Intensity: 20mW/sr @ 20mA
U11 = CH340C: 应用功能:收发器;接口协议:USB 2.0;数据速率:2Mbps;; LCSC Part Name: CH340C USB转串口芯片 CH340; Supplier Part: C84681; Manufacturer: WCH(南京沁恒); Supplier Footprint: SOP-16; JLCPCB Part Class: 扩展库; Datasheet: https://atta.szlcsc.com/upload/public/pdf/source/20200819/C84681_ADBED554CE321879DBD6B1D06488689C.pdf; Supplier: LCSC; Applications Function: 收发器; Protocol: USB 2.0; Data Rate: 2Mbps; Supply Voltage: 3.3V；5V
U12 = ESP32-WROOM-32E-N8_C701342: ESP32-WROOM-32E 集成 ESP32-D0WD-V3 芯片，具有?高的稳定性和安全性能。; LCSC Part Name: 通用型Wi-Fi+BT+BLE的MCU模组 PCB板载天线模组; Supplier Part: C701342; Manufacturer: ESPRESSIF(乐鑫); Supplier Footprint: SMD,18x25.5mm; Datasheet: https://atta.szlcsc.com/upload/public/pdf/source/20200730/C701341_95E089979D39CD8D2471FDC7C7AF29A1.pdf; Supplier: LCSC
U13 = DW254W-11-06-85: 排数:单排;总孔位数:6P;间距:2.54mm;插孔结构:1x6P;行距:-;安装类型:弯插;圆孔/方孔:方孔;额定电流:3A;额定电压:-;插孔方向:侧面;塑高:8.5mm;工作温度范围:-;; LCSC Part Name: 间距:2.54mm 1x6P 弯插; Supplier Part: C2935996; Manufacturer: DEALON(德艺隆); Supplier Footprint: 弯插,P=2.54mm; JLCPCB Part Class: Extended Part; Datasheet: https://atta.szlcsc.com/upload/public/pdf/source/20211231/3C4D2E6B78ED2773EE45870C43BA2BC5.pdf; Supplier: LCSC; Number of Rows: 单排; Number of Holes: 6P; Pitch: 2.54mm; Holes Structure: 1x6P; Mounting Type: 弯插; Circular Hole / Square Hole: 方孔; Current Rating (Max): 3A; Holes Direction: 侧面; Insulation Height: 8.5mm
U15 = SHT30-DIS-B10KS: 立创商城  C77361  可替换，两者仅包装不一样。; LCSC Part Name: 1-101173-01; Supplier Part: C2687423; Manufacturer: Sensirion(瑞士盛思锐); Supplier Footprint: DFN-8-EP(2.5x2.5); JLCPCB Part Class: Extended Part; Datasheet: https://atta.szlcsc.com/upload/public/pdf/source/20210120/C2687423_31DB3FACC3E95675626B9DEF500B4777.pdf; Supplier: LCSC
U16 = LTR-553ALS-01: 类型:-;波长:-;近距离探测:-;输出类型:-;; LCSC Part Name: 三合一光传感器; Supplier Part: C492375; Manufacturer: LITEON(台湾光宝); Supplier Footprint: SMD; Supplier: LCSC; JLCPCB Part Class: Extended Part
U17 = AMS1117-3.3_C6186: 输出类型:固定;输出极性:正;最大输入电压:-;输出电压:3.3V;输出电流:1A;电源纹波抑制比(PSRR):72dB@(120Hz);; LCSC Part Name: 输出3.3V 1A; Supplier Part: C6186; Manufacturer: AMS; Supplier Footprint: SOT-223; JLCPCB Part Class: Basic Part; Datasheet: https://atta.szlcsc.com/upload/public/pdf/source/20180727/C6186_7A095716F0823C02F1997A905E26C086.pdf; Supplier: LCSC; Output Type: 固定; Output Polarity: 正; Number of Outputs: 1; Output Voltage: 3.3V; Dropout Voltage: 1.3V@(800mA); Output Current: 1A; Power Supply Rejection Ratio (PSRR): 72dB@(120Hz)
U18 = HS96L03W2C03: 尺寸(inch)：0.96寸 0.96' 像素分辨率：128x64 128*64主控芯片：SSD1315 接口类型：I2C 外形:27.3*27.8；IIC/3SPI/4SPI串口通讯,工作温度范围-40℃—+70℃。4PIN黑底白光。; LCSC Part Name: 0.96寸OLED显示屏窄白光IIC; Supplier Part: C5248080; Manufacturer: HS(汉昇); JLCPCB Part Class: 扩展库; Datasheet: https://atta.szlcsc.com/upload/public/pdf/source/20230627/763D01F79A90007632F098068C7C8AD9.pdf; Supplier: LCSC
U19 = DS1302ZM: 工业级 具有涓细电流充电能力的低功耗实时时钟芯片; Supplier Part: C910859; Manufacturer: HGSEMI(华冠); Supplier Footprint: SOP-8; Supplier: LCSC
USBC1 = TYPE-C-31-M-12: 连接器类型:Type-C;标准:-;公母:母座;触点数量:16P;端口数量:1;安装方式:-;额定电流 - 电源:5A;触头材质:-;触头镀层:-;工作温度范围:-;焊接温度(最大值):-;; LCSC Part Name: Type-C 母座; Supplier Part: C165948; Manufacturer: 韩国韩荣; Supplier Footprint: SMD; JLCPCB Part Class: 扩展库; Datasheet: https://atta.szlcsc.com/upload/public/pdf/source/20220525/466408E853115E789EDB0DDC29077C05.pdf; Supplier: LCSC; Connector Type: Type-C; Gender: 母座; Number of Contacts: 16P; Number of Ports: 1; Current Rating - Power (Max): 5A
X1 X2 = Q13FC1350000400: 频率:32.768kHz;频率公差:±20ppm;负载电容:12.5pF;; LCSC Part Name: 32.768kHz ±20ppm 12.5pF; Supplier Part: C32346; Manufacturer: EPSON(爱普生); Supplier Footprint: SMD3215-2P; JLCPCB Part Class: 基础库; Datasheet: https://atta.szlcsc.com/upload/public/pdf/source/20190108/C32346_746D6B07EAF90824457A96480007685F.pdf; Supplier: LCSC; Crystal Type: 贴片无源晶振; Frequency Tolerance: ±20ppm; Load Capacitance: 12.5pF; Equivalent Series Resistance (ESR): 70kΩ; Operating Temperature: -40℃~+85℃
XP1 = KF128L-5.0-3P: Manufacturer: KEFA(科发); Manufacturer Part: KF128L-5.0-2P; Supplier: LCSC; Supplier Part: C474939; link: https://atta.szlcsc.com/upload/public/pdf/source/20200115/C474938_80708D3EE0FCBB608268E83D2CCC8A9C.pdf

## Nets
3.3V: BUZZER1.1(+) C7.2 C19.2 C21.2 C26.1 C31.1 C33.2 C34.2 C35.1 C36.2 C39.1 C40.1 CARD1.4(VDD) CN2.1 CN2.2 CN2.3 CN2.4 D4.1 LCD1.6(VCC) LCD1.12(LED) R2.2 R4.2 R7.1 R11.1 R27.3 R32.2 R34.2 R35.2 R36.2 R37.2 R39.1 R40.1 R41.1 R43.2 R44.1 R46.1 R47.2 R48.1 R49.1 R50.1 R51.1 R52.1 R53.1 R54.1 R55.1 R56.1 R57.1 RELAY1.2 U1.16(VCC) U11.4(V3) U11.16(VCC) U12.2(3V3) U13.2 U15.5(VDD) U15.6(nRESET) U16.5(LED A) U16.8(VDD) U17.2(VOUT) U17.4(VOUT) U18.2(VCC) U19.1(VCC2)
5V: C5.1 C9.1 C15.1 C18.1 C23.1 C27.1 C30.2 C32.2 CN1.1 CN1.2 CN1.3 CN1.4 D2.1(C) LED3.1(VDD) LED4.1(VDD) LED6.1(VDD) LED7.1(VDD) LED10.1(VDD) LED11.1(VDD) Q1.2(S) R15.1 R20.1 R23.2 R24.2 U17.3(VIN)
GND: B1.2 BT1.1 BT2.1 C1.1 C2.1 C3.2 C4.1 C5.2 C6.1 C7.1 C8.1 C9.2 C10.2 C11.2 C12.1 C13.1 C14.1 C15.2 C16.1 C18.2 C19.1 C21.1 C22.1 C23.2 C24.1 C25.2 C26.2 C27.2 C28.2 C29.2 C30.1 C31.2 C32.1 C33.1 C34.1 C35.2 C36.1 C37.1 C38.1 C39.2 C40.2 CARD1.6(VSS) CARD1.10(SHELL) CARD1.11(SHELL) CARD1.12(SHELL) CARD1.13(SHELL) CN3.1 CN3.2 CN3.3 CN3.4 D1.2(A) DC1.2 DC1.3 LCD1.7(GND) LED3.3(VSS) LED4.3(VSS) LED5.1(K) LED6.3(VSS) LED7.3(VSS) LED10.3(VSS) LED11.3(VSS) LED12.1(K) LED13.1(K) LED15.1(K) LEDIR1.1(K) Q6.2(E) Q7.2(E) R1.2 R3.1 R5.1 R10.1 R12.2 R19.1 R26.1 R28.2 R33.2 R38.1 R45.2 SW1.2 SW2.2 SW7.2 U1.1(GND) U2.7(GND) U2.9 U3.2(GND) U4.1(AAM) U4.4(GND) U11.1(GND) U12.1(GND) U12.15(GND) U12.32(NC) U12.38(GND) U12.39(GND) U13.3 U15.7(R) U15.8(VSS) U15.9(EP) U16.6(GND) U17.1(GND) U18.1(GND) U19.4(GND) USBC1.0(SH) USBC1.1(SH) USBC1.2(SH) USBC1.3(SH) USBC1.A1(GND) USBC1.A12(GND) USBC1.B1(GND) USBC1.B12(GND)
VIN_5V: D2.2(A) PSW1.2 Q1.1(G) R3.2 R13.1
BAT: C25.1 R25.1 R26.2 U12.27(IO16)
BAT+: BT1.2 BT2.2 C13.2 C14.2 C16.2 L1.2 R25.2 U2.6(BAT)
BUZ: R29.2 U12.28(IO17)
DC_5V: C20.1 C22.2 C24.2 L2.2 PSW1.1 R22.2
EN: C28.1 Q5.3(C) R32.1 SW1.1 U12.3(EN)
ESP32_RX: LED9.1(K) U11.2(TXD) U12.34(RXD0) U13.4
ESP32_TX: LED8.1(K) U11.3(RXD) U12.35(TXD0) U13.5
IO0: C29.1 Q4.3(C) R34.1 SW2.1 U12.25(IO0)
KEY_D: R49.2 SW5.1(A) SW5.2(B) U12.9(IO33)
KEY_L: R57.2 SW8.1(A) SW8.2(B) U12.11(IO26)
KEY_M: R41.2 SW3.1(A) SW3.2(B) U12.10(IO25)
KEY_R: R54.2 SW6.1(A) SW6.2(B) U12.8(IO32)
KEY_U: R46.2 SW4.1(A) SW4.2(B) U12.12(IO27)
LUM: R27.2 R28.1 U12.5(SENSOR_VN)
OLED_SCL: R2.1 R36.1 R39.2 R53.2 U1.2(SCL) U12.36(IO22) U15.4(SCL) U16.7(SCL) U18.3(SCL) U19.7(SCLK)
OLED_SDA: R4.1 R37.1 R40.2 R55.2 U1.3(SDA) U12.33(IO21) U15.1(SDA) U16.1(SDA) U18.4(SDA) U19.6(I/O)
PA1: R9.1 R21.1 U1.9(PA1)
PRX: R35.1 U12.14(IO12) U16.2(INT)
RGB: LED3.4(DIN) U12.26(IO4)
RLY: R42.2 U12.4(SENSOR_VP)
SD_CLK: CARD1.5(CLX) R50.2 U12.13(IO14)
SD_MISO: CARD1.7(DAT0) R48.2 U12.24(IO2)
SD_MOSI: CARD1.3(CMD) R51.2 U12.23(IO15)
SD_SS: CARD1.2(CD/DAT3) R52.2 U12.16(IO13)
TFT_CLK: LCD1.14(SCK) U12.30(IO18)
TFT_CS: LCD1.8(CS) U12.29(IO5)
TFT_MISO: LCD1.13(SDO/MISO) U12.31(IO19)
TFT_MOSI: LCD1.11(SCI/MOSI) U12.37(IO23)
TFT_RS: LCD1.10(DC/RS) U12.7(IO35)
TFT_RST: LCD1.9(RST) U12.6(IO34)
USB_5V: PSW1.3 R14.2 USBC1.A4(VBUS) USBC1.A9(VBUS) USBC1.B4(VBUS) USBC1.B9(VBUS)
USB_D+: U11.5(D+) USBC1.A6(DP1) USBC1.B6(DP2)
USB_D-: U11.6(D-) USBC1.A7(DN1) USBC1.B7(DN2)
$B1_1: B1.1 U19.8(VCC1)
$BUZZER1_2: BUZZER1.2(-) Q6.3(C)
$C1_2: C1.2 U1.7(XI) X1.2
$C2_2: C2.2 U1.8(XO) X1.1
$C3_1: C3.1 C4.2 D3.1(K) Q1.3(D) U2.1(VOUT)
$C6_2: C6.2 C8.2 D1.1(K) DC1.1 R8.1 U4.2(VIN)
$C10_1: C10.1 U4.7(VCC)
$C11_1: C11.1 R11.2 U3.3(VCC)
$C12_2: C12.2 R6.1 R13.2 U2.5(VCC)
$C17_1: C17.1 L2.1 U4.3(SW)
$C17_2: C17.2 R16.2
$C20_2: C20.2 R18.1 R19.2 R22.1
$C37_2: C37.2 U19.2(X1) X2.2
$C38_2: C38.2 U19.3(X2) X2.1
$D3_2: D3.2(A) L1.1 U2.8(LX)
$D4_2: D4.2 LED14.1(C) Q7.3(C) RELAY1.1
$LED1_1: LED1.1(K) U2.2(CHRG#)
$LED1_2: LED1.2(A) LED2.2(A) R6.2
$LED2_1: LED2.1(K) U2.4(STDBY#)
$LED3_2: LED3.2(DOUT) LED4.4(DIN)
$LED4_2: LED4.2(DOUT) LED6.4(DIN)
$LED5_2: LED5.2(A) R14.1
$LED6_2: LED6.2(DOUT) LED7.4(DIN)
$LED7_2: LED7.2(DOUT) LED10.4(DIN)
$LED8_2: LED8.2(A) R23.1
$LED9_2: LED9.2(A) R24.1
$LED10_2: LED10.2(DOUT) LED11.4(DIN)
$LED12_2: LED12.2(A) SW3.3(C) SW3.4(D) SW4.3(C) SW4.4(D) SW5.3(C) SW5.4(D) SW6.3(C) SW6.4(D) SW8.3(C) SW8.4(D)
$LED13_2: LED13.2(A) R44.2
$LED14_2: LED14.2(A) R43.1
$LED15_2: LED15.2(A) R47.1
$LEDIR1_2: LEDIR1.2(A) Q2.2(E) Q3.2(E) R17.1
$Q2_1: Q2.1(B) R9.2 R10.2
$Q2_3: Q2.3(C) U5.2(C) U6.2(C) U7.2(C)
$Q3_1: Q3.1(B) R17.2 R21.2
$Q3_3: Q3.3(C) U8.2(C) U9.2(C) U10.2(C)
$Q4_1: Q4.1(B) R30.1
$Q4_2: Q4.2(E) R31.2 U11.13(DTR#)
$Q5_1: Q5.1(B) R31.1
$Q5_2: Q5.2(E) R30.2 U11.14(RTS#)
$Q6_1: Q6.1(B) R29.1 R33.1
$Q7_1: Q7.1(B) R42.1 R45.1
$R1_1: R1.1 USBC1.B5(CC2)
$R5_2: R5.2 U2.3(PROG)
$R7_2: R7.2 U1.13(PA0) U3.1(OUT)
$R8_2: R8.2 U4.6(EN)
$R12_1: R12.1 USBC1.A5(CC1)
$R15_2: R15.2 U5.1(A) U6.1(A) U7.1(A)
$R16_1: R16.1 U4.5(BST)
$R18_2: R18.2 U4.8(FB)
$R20_2: R20.2 U8.1(A) U9.1(A) U10.1(A)
$R38_2: R38.2 U15.2(ADDR)
$R56_2: R56.2 SW7.1 U19.5(RST)
$RELAY1_3: RELAY1.3 XP1.2
$RELAY1_4: RELAY1.4 XP1.1
$RELAY1_5: RELAY1.5 XP1.3
$U16_3: U16.3(LDR) U16.4(LED K)

Not connected (* = marked no-connect by the designer): CARD1 1(DAT2)* 8(DAT1)* 9(CD)*; LCD1 1(T_IRQ) 2(T_DO) 3(T_DIN) 4(T_CS) 5(T_CLK) 15(SD-CS)* 16(SD-MOSI)* 17(SD-SIMO)* 18(SD-SCK)*; LED11 2(DOUT)*; PSW1 0*; R27 1*; TP1 1; TP2 1; TP3 1; TP4 1; U1 4(TXD)* 5(RXD)* 6(UD-)* 10(DSR#)* 11(RI#)* 12(DCD#)* 14(RTS#)* 15(R232)*; U11 7(NC.)* 8(NC.)* 9(CTS#)* 10(DSR#)* 11(RI#)* 12(DCD#)* 15(R232)*; U12 17(NC)* 18(NC)* 19(NC)* 20(NC)* 21(NC)* 22(NC)*; U13 1* 6*; U15 3(ALERT)*; USBC1 A8(SBU1)* B8(SBU2)*

## Notes on the sheet
- USB-TypeC
- USB-TTL
- LDO
- Button
- ESP32-Gateway
- Hardware Ver V2.2
- -Zheyuan Zhang
- RTS
- DTR
- OLED Panel
- Tf Card
- UPS
- ESP32-WROOM
- VOUT
- Temp/Hum Sensor
- RT Clock
- 5V-16V DC-DC
- BT
- Connector
- +5V-16V
- Relay
- JDY-10M
- NC
- COM
- TFT LCD
- Proximity Sensor
- NO
- IR Emitter
- SOC
- LUM
- RGB
- Buzzer
